# EAGLE design FluoroDuino (EAGLE 6.2)
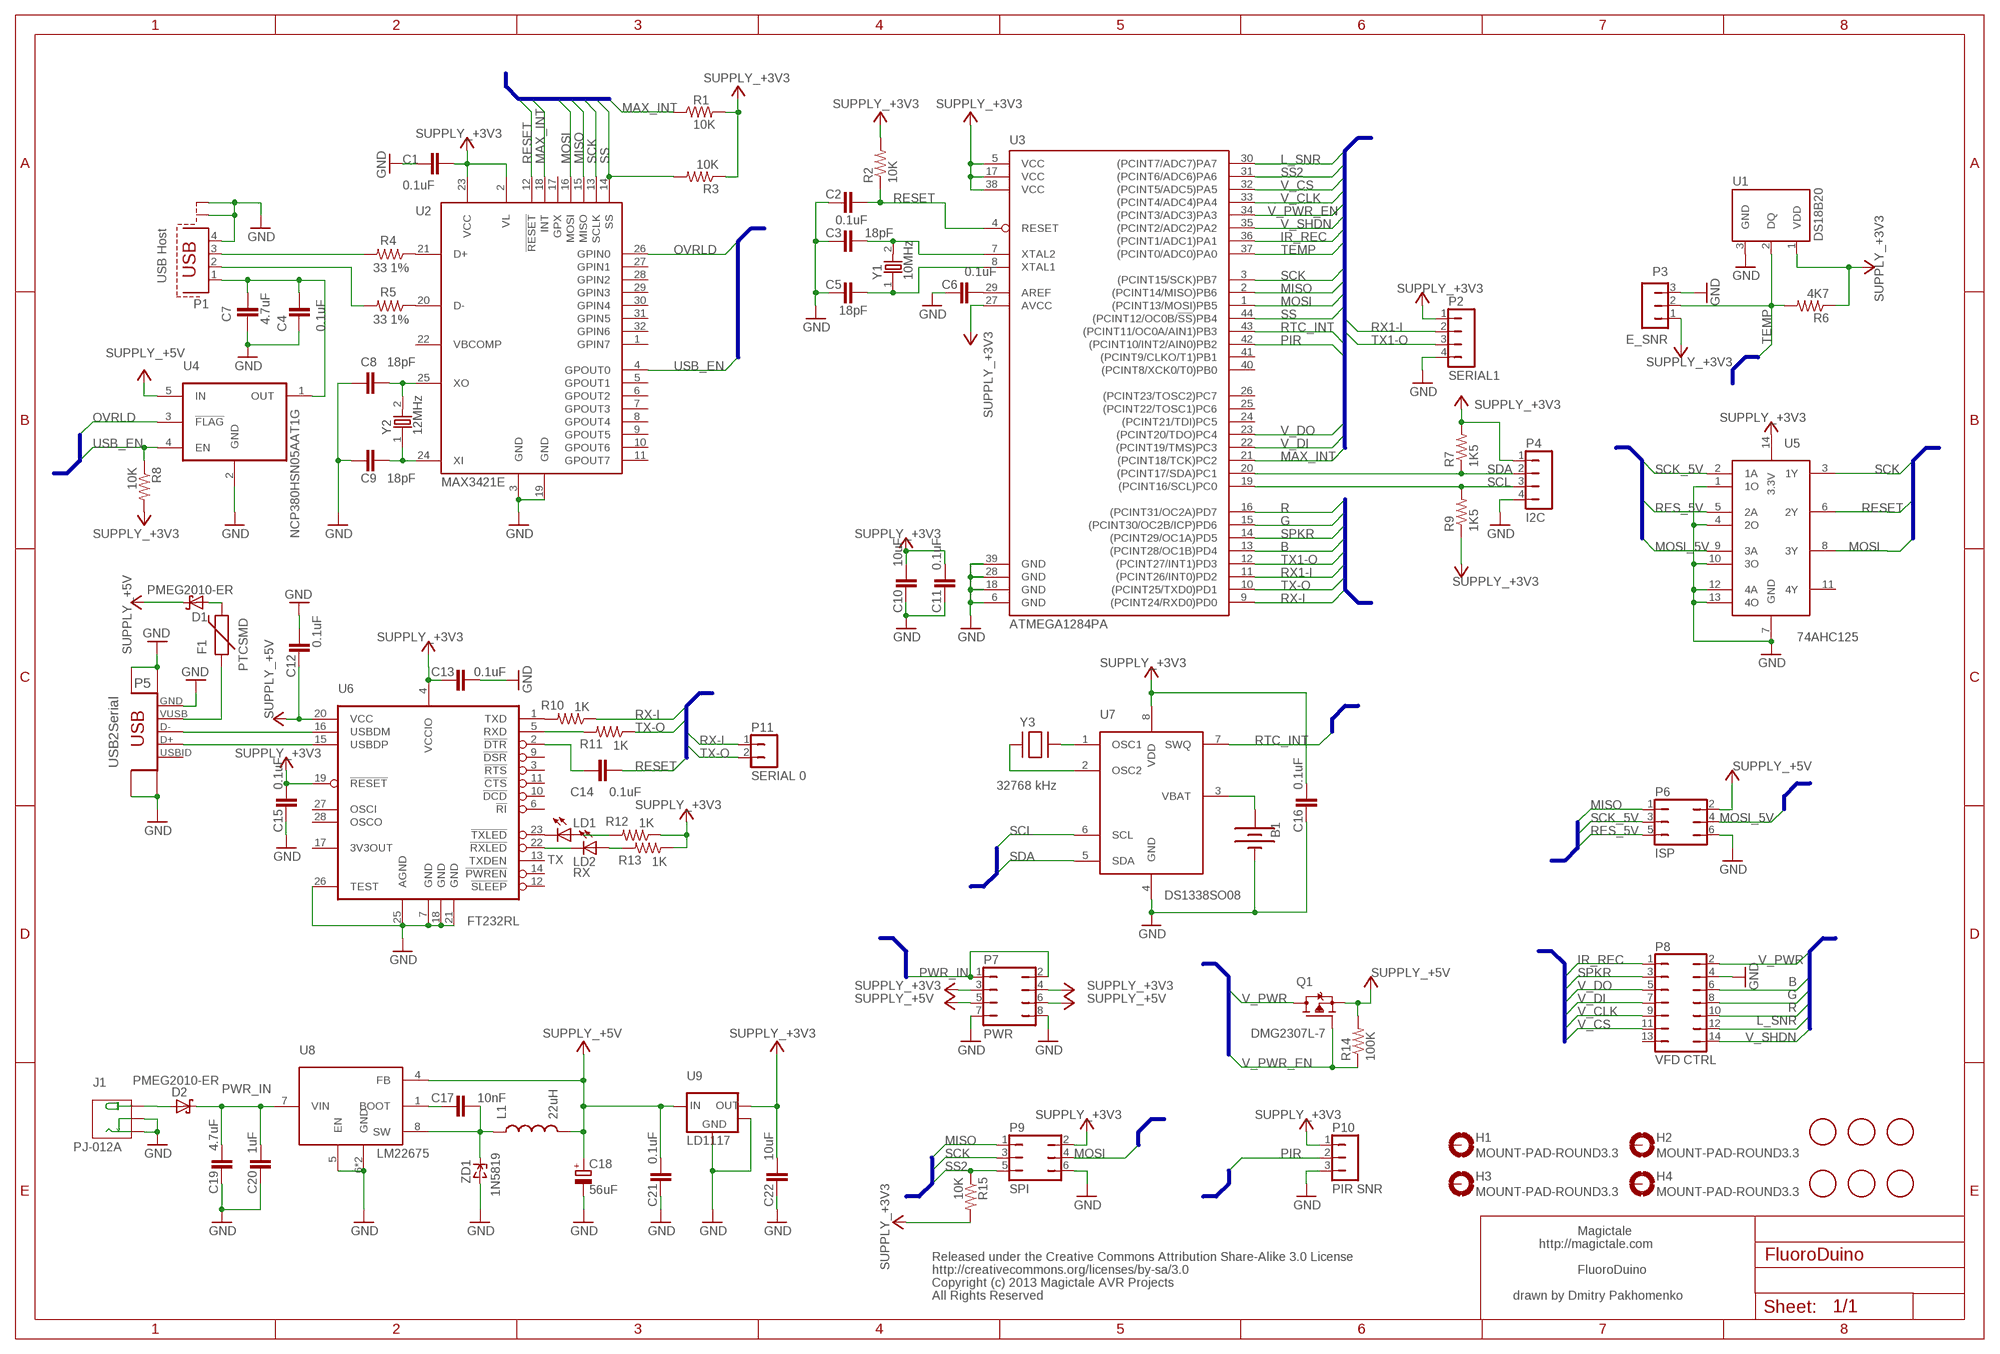
[diagram p0: schematic, sheet 1]

## Parts
B1  BATTERY20PTH  [BATTCOM_20MM_PTH]
C1  0.1uF  CAPACITOR_NPOL-1206  [C1206]
C2  0.1uF  CAPACITOR_NPOL-1206  [C1206]
C3  18pF  CAPACITOR_NPOL-1206  [C1206]
C4  0.1uF  CAPACITOR_NPOL-1206  [C1206]
C5  18pF  CAPACITOR_NPOL-1206  [C1206]
C6  0.1uF  CAPACITOR_NPOL-1206  [C1206]
C7  4.7uF  CAPACITOR_NPOL-1206  [C1206]
C8  18pF  CAPACITOR_NPOL-1206  [C1206]
C9  18pF  CAPACITOR_NPOL-1206  [C1206]
C10  10uF  CAPACITOR_NPOL-1206  [C1206]
C11  0.1uF  CAPACITOR_NPOL-1206  [C1206]
C12  0.1uF  CAPACITOR_NPOL-1206  [C1206]
C13  0.1uF  CAPACITOR_NPOL-1206  [C1206]
C14  0.1uF  CAPACITOR_NPOL-1206  [C1206]
C15  0.1uF  CAPACITOR_NPOL-1206  [C1206]
C16  0.1uF  CAPACITOR_NPOL-1206  [C1206]
C17  10nF  CAPACITOR_NPOL-1206  [C1206]
C18  56uF  CAPACITOR_POL  [PANASONIC_C]
C19  4.7uF  CAPACITOR_NPOL-1206  [C1206]
C20  1uF  CAPACITOR_NPOL-1206  [C1206]
C21  0.1uF  CAPACITOR_NPOL-1206  [C1206]
C22  10uF  CAPACITOR_NPOL-1206  [C1206]
D1  PMEG2010-ER  [SOD123]
D2  PMEG2010-ER  [SOD123]
F1  PTCSMD  [PTC-1206]
FIDUTIAL1  FIDUCIAL  [FIDUCIAL_1MM]
FIDUTIAL2  FIDUCIAL  [FIDUCIAL_1MM]
FIDUTIAL3  FIDUCIAL  [FIDUCIAL_1MM]
FIDUTIAL4  FIDUCIAL  [FIDUCIAL_1MM]
FIDUTIAL5  FIDUCIAL  [FIDUCIAL_1MM]
FIDUTIAL6  FIDUCIAL  [FIDUCIAL_1MM]
H1  MOUNT-PAD-ROUND3.3  [3,3-PAD]
H2  MOUNT-PAD-ROUND3.3  [3,3-PAD]
H3  MOUNT-PAD-ROUND3.3  [3,3-PAD]
H4  MOUNT-PAD-ROUND3.3  [3,3-PAD]
J1  PJ-012A  [PJ-012A]
L1  22uH  INDUCTOR  [VLC6045]
LD1  TX  LEDCHIPLED_1206  [CHIPLED_1206]
LD2  RX  LEDCHIPLED_1206  [CHIPLED_1206]
P1  USB Host  USB-AVERT  [USB-A-VER]
P2  SERIAL1  CONN_HEADER_1X04STRAIGHT  [CONN_HEADER_1X04]
P3  E_SNR  CONN_HEADER_1X03STRAIGHT  [CONN_HEADER_1X03]
P4  I2C  CONN_HEADER_1X04STRAIGHT  [CONN_HEADER_1X04]
P5  USB2Serial  CON-USB-F-MINI-B-RA  [CONN_USB_MINI_RA]
P6  ISP  CONN_HEADER_2X03  [CONN_HEADER_2X03]
P7  PWR  CONN_HEADER_2X04  [CONN_HEADER_2X04]
P8  VFD CTRL  CONN_HEADER_2X07F_MIRR  [CONN_HEADER_2X07_F_MIRR]
P9  SPI  CONN_HEADER_2X03  [CONN_HEADER_2X03]
P10  PIR SNR  CONN_HEADER_1X03STRAIGHT  [CONN_HEADER_1X03]
P11  SERIAL 0  CONN_HEADER_1X02  [CONN_HEADER_1X02]
Q1  DMG2307L-7  TRANSISTOR_FET_TSM2301CX  [SOT-23]
R1  10K  RESISTOR-1206  [R1206]
R2  10K  RESISTOR-1206  [R1206]
R3  10K  RESISTOR-1206  [R1206]
R4  33 1%  RESISTOR-1206  [R1206]
R5  33 1%  RESISTOR-1206  [R1206]
R6  4K7  RESISTOR-1206  [R1206]
R7  1K5  RESISTOR-1206  [R1206]
R8  10K  RESISTOR-1206  [R1206]
R9  1K5  RESISTOR-1206  [R1206]
R10  1K  RESISTOR-1206  [R1206]
R11  1K  RESISTOR-1206  [R1206]
R12  1K  RESISTOR-1206  [R1206]
R13  1K  RESISTOR-1206  [R1206]
R14  100K  RESISTOR-1206  [R1206]
R15  10K  RESISTOR-1206  [R1206]
U1  DS18B20  [TO-92-AMMO]
U2  MAX3421E  MAXIM_MAX3421E  [TQFP32-08]
U3  ATMEGA1284PA  [TQFP44]
U4  NCP380HSN05AAT1G  POWERSW_FIX-SOT5-1  [SOT23-5]
U5  74AHC125  CH_LOGIC_74125_33V-SO  [SO014]
U6  FT232RL  IC_FT232RL  [SSOP-28]
U7  DS1338SO08  ICS_DS1338SO08  [SO08]
U8  LM22675  ICS_LM22675  [SO08_POWER_PAD]
U9  LD1117  V_REG_LD1117SOT223  [SOT223]
U$  MT_LOGOCOMPACT  [MT_LOGO_COMPACT]
Y1  10MHz  OSC-XTAL-12M  [XTAL_4X6]
Y2  12MHz  OSC-XTAL-12M  [XTAL_4X6]
Y3  32768 kHz  XTAL-3.2X1.5  [XTAL3215]
ZD1  1N5819  ZENERSOD-123  [SOD123]

## Nets
+3V3: C1.1 C10.2 C11.2 C13.1 C15.2 C16.2 C22.2 P2.1 P3.1 P4.1 P7.3 P7.4 P9.2 P10.1 R1.2 R2.2 R3.1 R6.1 R7.2 R8.2 R9.1 R12.1 R13.1 R15.2 U1.1(VDD) U2.2(VL) U2.23(VCC) U3.5(VCC) U3.17(VCC) U3.27(AVCC) U3.38(VCC) U5.14(3.3V) U6.4(VCCIO) U6.19(!RESET) U7.8(VDD) U9.2(OUT) ; supply symbol labelled SUPPLY_+3V3
+5V: C12.1 C18.+ C21.2 D1.C L1.2 P6.2 P7.5 P7.6 Q1.2(S) R14.2 U4.5(IN) U6.20(VCC) U8.4(FB) U9.3(IN) ; supply symbol labelled SUPPLY_+5V
B: P8.6 U3.13((PCINT28/OC1B)PD4)
G: P8.8 U3.15((PCINT30/OC2B/ICP)PD6)
GND [power]: B1.2(-) C1.2 C2.1 C3.1 C4.2 C5.1 C6.1 C7.1 C8.1 C9.1 C10.1 C11.1 C12.2 C13.2 C15.1 C16.1 C18.- C19.1 C20.1 C21.1 C22.1 J1.2 J1.3 P1.4 P1.S1 P1.S2 P2.4 P3.3 P4.4 P5.5(GND) P5.S1(BODY) P5.S2(BODY) P5.S3(BODY) P5.S4(BODY) P6.6 P7.7 P7.8 P8.4 P9.6 P10.3 U1.3(GND) U2.3(GND) U2.19(GND) U3.6(GND) U3.18(GND) U3.28(GND) U3.39(GND) U4.2(GND) U5.1(1O) U5.4(2O) U5.7(GND) U5.10(3O) U5.12(4A) U5.13(4O) U6.7(GND) U6.18(GND) U6.21(GND) U6.25(AGND) U6.26(TEST) U7.4(GND) U8.5(EN) U8.6(GND) U8.BODY@1(GND) U9.1(GND) U9.4(OUT) ZD1.A
IR_REC: P8.1 U3.36((PCINT1/ADC1)PA1)
L_SNR: P8.12 U3.30((PCINT7/ADC7)PA7)
MAX_INT: R1.1 U2.18(INT) U3.21((PCINT18/TCK)PC2)
MISO: P6.1 P9.1 U2.15(MISO) U3.2((PCINT14/MISO)PB6)
MOSI: P9.4 U2.16(MOSI) U3.1((PCINT13/MOSI)PB5) U5.8(3Y)
MOSI_5V: P6.4 U5.9(3A)
N$1: U7.1(OSC1) Y3.P$2
N$2: U7.2(OSC2) Y3.P$1
N$3: B1.1(+) U7.3(VBAT)
N$4: P5.3(D+) U6.15(USBDP)
N$5: P5.2(D-) U6.16(USBDM)
N$6: D1.A F1.2
N$7: LD1.C U6.23(!TXLED)
N$8: R11.2 U6.5(RXD)
N$9: R10.2 U6.1(TXD)
N$10: LD2.C U6.22(!RXLED)
N$11: LD1.A R12.2
N$12: LD2.A R13.2
N$13: C14.2 U6.2(!DTR)
N$14: C9.2 U2.24(XI) Y2.1
N$15: C8.2 U2.25(XO) Y2.2
N$16: R4.1 U2.21(D+)
N$17: R5.1 U2.20(D-)
N$18: P1.3 R4.2
N$19: P1.2 R5.2
N$20: F1.1 P5.1(VUSB)
N$21: D2.A J1.1
N$22: C4.1 C7.2 P1.1 U4.1(OUT)
N$23: C17.1 U8.1(BOOT)
N$24: C6.2 U3.29(AREF)
N$25: C17.2 L1.1 U8.8(SW) ZD1.C
OVRLD: U2.26(GPIN0) U4.3(!FLAG)
PIR: P10.2 U3.42((PCINT10/INT2/AIN0)PB2)
PWR_IN: C19.2 C20.2 D2.C P7.1 P7.2 U8.7(VIN)
R: P8.10 U3.16((PCINT31/OC2A)PD7)
RES_5V: P6.5 U5.5(2A)
RESET: C2.2 C14.1 R2.1 U2.12(!RESET) U3.4(RESET) U5.6(2Y)
RTC_INT: U3.43((PCINT11/OC0A/AIN1)PB3) U7.7(SWQ)
RX1-I: P2.2 U3.11((PCINT26/INT0)PD2)
RX-I: P11.1 R10.1 U3.9((PCINT24/RXD0)PD0)
SCK: P9.3 U2.13(SCLK) U3.3((PCINT15/SCK)PB7) U5.3(1Y)
SCK_5V: P6.3 U5.2(1A)
SCL: P4.3 R9.2 U3.19((PCINT16/SCL)PC0) U7.6(SCL)
SDA: P4.2 R7.1 U3.20((PCINT17/SDA)PC1) U7.5(SDA)
SPKR: P8.3 U3.14((PCINT29/OC1A)PD5)
SS: R3.2 U2.14(SS) U3.44((PCINT12/OC0B/!SS!)PB4)
SS2: P9.5 R15.1 U3.31((PCINT6/ADC6)PA6)
TEMP: P3.2 R6.2 U1.2(DQ) U3.37((PCINT0/ADC0)PA0)
TX1-O: P2.3 U3.12((PCINT27/INT1)PD3)
TX-O: P11.2 R11.1 U3.10((PCINT25/TXD0)PD1)
USB_EN: R8.1 U2.4(GPOUT0) U4.4(EN)
V_CLK: P8.9 U3.33((PCINT4/ADC4)PA4)
V_CS: P8.11 U3.32((PCINT5/ADC5)PA5)
V_DI: P8.7 U3.22((PCINT19/TMS)PC3)
V_DO: P8.5 U3.23((PCINT20/TDO)PC4)
V_PWR: P8.2 Q1.3(D)
V_PWR_EN: Q1.1(G) R14.1 U3.34((PCINT3/ADC3)PA3)
V_SHDN: P8.14 U3.35((PCINT2/ADC2)PA2)
XTAL1: C3.2 U3.7(XTAL2) Y1.2
XTAL2: C5.2 U3.8(XTAL1) Y1.1
Unconnected: H1.B3,3(MOUNT) H2.B3,3(MOUNT) H3.B3,3(MOUNT) H4.B3,3(MOUNT) P5.4(USBID) P8.13 U2.1(GPIN7) U2.5(GPOUT1) U2.6(GPOUT2) U2.7(GPOUT3) U2.8(GPOUT4) U2.9(GPOUT5) U2.10(GPOUT6) U2.11(GPOUT7) U2.17(GPX) U2.22(VBCOMP) U2.27(GPIN1) U2.28(GPIN2) U2.29(GPIN3) U2.30(GPIN4) U2.31(GPIN5) U2.32(GPIN6) U3.24((PCINT21/TDI)PC5) U3.25((PCINT22/TOSC1)PC6) U3.26((PCINT23/TOSC2)PC7) U3.40((PCINT8/XCK0/T0)PB0) U3.41((PCINT9/CLKO/T1)PB1) U5.11(4Y) U6.3(!RTS) U6.6(!RI) U6.9(!DSR) U6.10(!DCD) U6.11(!CTS) U6.12(!SLEEP) U6.13(TXDEN) U6.14(!PWREN) U6.17(3V3OUT) U6.27(OSCI) U6.28(OSCO)

## Buses
CTRLBUS:R,G,B,L_SNR,V_PWR,V_SHDN
CTRLBUS:R,G,SPKR,B,TX1-O,RX1-I,TX-O,RX-I
CTRLBUS:L_SNR,SS2,V_CS,V_CLK,V_PWR_EN,V_SHDN,IR_REC,TEMP,SCK,MISO,MOSI,SS,RTC_INT,PIR,V_DO,V_DI,MAX_INT,RX1-I,TX1-O
CTRLBUS:MOSI,MOSI_5V
CTRLBUS:MISO,SCK,SS2,SCK_5V,RES_5V
CTRLBUS:SPKR,IR_REC,V_DO,V_DI,V_CLK,V_CS,E_VSEG
CTRLBUS:SDA,SCL
CTRLBUS:RESET,MAX_INT,MOSI,MISO,SCK,SS
CTRLBUS:OVRLD,USB_EN
CTRLBUS:RX-I,TX-O,RESET
CTRLBUS:SCK,RESET,MOSI
CTRLBUS:SCK_5V,RES_5V,MOSI_5V
CTRLBUS:V_PWR,V_PWR_EN
CTRLBUS:TEMP
CTRLBUS:PIR
CTRLBUS:RTC_INT
CTRLBUS:PWR_IN

## Notes on the sheet
- Magictale
- http://magictale.com
- Released under the Creative Commons Attribution Share-Alike 3.0 License
- http://creativecommons.org/licenses/by-sa/3.0 | FluoroDuino
- Copyright (c) 2013 Magictale AVR Projects
- All Rights Reserved | drawn by Dmitry Pakhomenko

## Library data of the parts
B1 = magictale:BATTERY: Battery Holders Various common sizes : AA, AAA, 20mm coin cell and 12mm coin cell. 20MM_4LEGS, BATT-10373; DIGIKEY: BS-3-ND
C1 C2 C4 C6 C11-C16 C21 = magictale:CAPACITOR_NPOL: Non-Polarized capacitor in various packages; DIGIKEY: 445-14296-1-ND
C3 C5 C8 C9 = magictale:CAPACITOR_NPOL: Non-Polarized capacitor in various packages; DIGIKEY: 1276-1844-1-ND
C7 C19 = magictale:CAPACITOR_NPOL: Non-Polarized capacitor in various packages; DIGIKEY: 445-14685-1-ND
C10 = magictale:CAPACITOR_NPOL: Non-Polarized capacitor in various packages; DIGIKEY: 276-3044-1-ND
C17 = magictale:CAPACITOR_NPOL: Non-Polarized capacitor in various packages; DIGIKEY: 399-1234-1-ND
C18 = magictale:CAPACITOR_POL: Polarized capacitor in various packages; DIGIKEY: P16502CT-ND
C20 = magictale:CAPACITOR_NPOL: Non-Polarized capacitor in various packages; DIGIKEY: 587-1434-1-ND
C22 = magictale:CAPACITOR_NPOL: Non-Polarized capacitor in various packages; DIGIKEY: 1276-3044-1-ND
D1 D2 = TKJMixed:PMEG2010-ER: 20V Schottky Diode at 1A - Forward voltage: 340mV @ 1A; DIGIKEY: 568-6504-1-ND
F1 = SparkFun-PowerIC:PTC: Resettable Fuse PTC Resettable Fuse. Spark Fun Electronics SKU : COM-08357; DIGIKEY: 507-1798-1-ND
FIDUTIAL1-FIDUTIAL6 = adafruit:FIDUCIAL: For use by pick and place machines to calibrate the vision/machine, 1mm By microbuilder.eu
H1-H4 = holes:MOUNT-PAD-ROUND: MOUNTING PAD, round
J1 = magictale:PJ-012A; DIGIKEY: CP-012A-ND
L1 = magictale:INDUCTOR: Inductors Basic Inductor/Choke - 0603 and 1206. Footprints are not proven and vary greatly between part numbers. SRN6045- 33uH, 20% 1.4A SDR0403-560KL - 56uH, 10%, 500mA RMS/740mA peak; DIGIKEY: 445-6533-1-ND
LD1 LD2 = adafruit:LED: LED OSRAM: - CHIPLED LG R971, LG N971, LY N971, LG Q971, LY Q971, LO R971, LY R971 LH N974, LH R974 LS Q976, LO Q976, LY Q976 LO Q996 - Hyper CHIPLED LW Q18S LB Q993, LB Q99A, LB R99A - SideLED LS A670, LO A670, LY A670, LG A670, LP A670 LB A673, LV A673, LT A673, LW A673 LH A674 LY A675 LS A676, LA A676, LO A676, LY A676, LW A676 LS A679, LY A679, LG A679 - Hyper Micro SIDELED® LS Y876, LA Y876, LO Y876, LY Y876 LT Y87S - SmartLED LW L88C, LW L88S LB L89C, LB L89S, LG L890 LS L89K, LO L89K, LY L89K LS L896, LA L896, LO L896, LY L896 - TOPLED LS T670, LO T670, LY T670, LG T670, LP T670 LSG T670, LSP T670, LSY T670, LOP T670, LYG T670 LG T671, LOG T671, LSG T671 LB T673, LV T673, LT T673, LW T673 LH T674 LS T676, LA T676, LO T676, LY T676, LB T676, LH T676, LSB T676, LW T676 LB T67C, LV T67C, LT T67C, LS T67K, LO T67K, LY T67K, LW E67C LS E67B, LA E67B, LO E67B, LY E67B, LB E67C, LV E67C, LT E67C LW T67C LS T679, LY T679, LG T679 LS T770, LO T770, LY T770, LG T770, LP T770 LB T773, LV T773, LT T773, LW T773 LH T774 LS E675, LA E675, LY E675, LS T675 LS T776, LA T776, LO T776, LY T776, LB T776 LHGB T686 LT T68C, LB T68C - Hyper Mini TOPLED® LB M676 - Mini TOPLED Santana® LG M470 LS M47K, LO M47K, LY M47K Source: http://www.osram.convergy.de/; DIGIKEY: 160-1737-1-ND
P1 = magictale:USB-A; DIGIKEY: 1175-1265-ND; OC_FARNELL: unknown; OC_NEWARK: unknown
P2 P4 = magictale:CONN_HEADER_1X04: 2.54 1x4 Header; DIGIKEY: SAM1034-02-ND; F_PIN: 1; L_PIN: 4
P3 P10 = magictale:CONN_HEADER_1X03: 2.54 1x3 Header; DIGIKEY: SAM1034-02-ND; F_PIN: 1; L_PIN: 3
P5 = magictale:CON-USB-F: USB Female connector; DIGIKEY: 732-2735-ND
P6 P9 = magictale:CONN_HEADER_2X03: 2.54 2x3 Header; DIGIKEY: 609-3210-ND; F_PIN: 1; L_PIN: 5
P7 = magictale:CONN_HEADER_2X04: 2.54 2x4 Header; DIGIKEY: 609-3235-ND; F_PIN: 1; L_PIN: 7
P8 = magictale:CONN_HEADER_2X07: JUMPER; DIGIKEY: OR1103-ND
P11 = magictale:CONN_HEADER_1X02; DIGIKEY: SAM1034-01-ND
Q1 = dp_devices:TRANSISTOR_FET_TSM2301CX: 20V P-Channel Enhancement Mode MOSFET; DIGIKEY: DMG2307L-7DICT-ND
R1-R3 R8 R15 = magictale:RESISTOR; DIGIKEY: RMCF1206JT10K0CT-ND
R4 R5 = magictale:RESISTOR; DIGIKEY: RMCF1206JT33R0
R6 = magictale:RESISTOR; DIGIKEY: RMCF1206JT4K70CT-ND
R7 R9 = magictale:RESISTOR; DIGIKEY: RNCP1206FTD1K50CT-ND
R10-R13 = magictale:RESISTOR; DIGIKEY: RMCF1206JT1K00CT-ND
R14 = magictale:RESISTOR; DIGIKEY: RMCF1206JT100KCT-ND
U1 = magictale:DS18B20: Alternate TO-92 NPN BJT; DIGIKEY: DS18B20+T&RCT-ND
U2 = magictale:MAXIM_MAX3421E; DIGIKEY: MAX3421EEHJ+-ND
U3 = TKJMixed:ATMEGA1284P: 8-bit Microcontroller with 128K Bytes In-System Programmable Flash Source: http://www.atmel.com/Images/doc8272.pdf Based on ATmega644; DIGIKEY: ATMEGA1284P-AURCT-ND; MPN: ATMEGA1284P-10AU
U4 = CH_misc_IC:POWERSW_FIX: USB power switch with fixed current limit. Package variant 1 fits OnSemi NCP380 , TI TPS20xxC, variant 2 fits Micrel MIC20X5, MIC2005A, MAX4789, MAX4791, MAX4793; DIGIKEY: NCP380HSN05AAT1GOSCT-ND
U5 = magictale:CH_LOGIC_74125_33V; DIGIKEY: 296-4530-1-ND
U6 = dp_devices:IC_FT232RL: USB to serial UART interface; DIGIKEY: 768-1007-1-ND
U7 = magictale:ICS_DS1338; DIGIKEY: DS1338U-33+T&RCT-ND
U8 = magictale:ICS_LM22675; DIGIKEY: LM22675MR-5.0/NOPB-ND
U9 = magictale:V_REG_LD1117: Voltage Regulator LM1117 Standard adjustable voltage regulator but in SMD form. Spark Fun Electronics SKU : COM-00595; DIGIKEY: 497-1241-1-ND
U$ = magictale:MT_LOGO; LICENSE: CC3.0; PCBREV: REV 1.0, 2013.12.07; PROJECT: FluoroDuino; URL: http://magictale.com
Y1 = magictale:OSC-XTAL; DIGIKEY: 535-9833-1-ND
Y2 = magictale:OSC-XTAL; DIGIKEY: 535-9836-1-ND
Y3 = adafruit:XTAL: Low cost SMT crystals, no capacitors included http://www.ladyada.net/library/eagle; DIGIKEY: 300-8816-1-ND
ZD1 = magictale:ZENER: Zener Diode SOD-323; DIGIKEY: 1N5819HW-FDICT-ND

## Net classes
0 default: width 0.203 mm, drill 0.305 mm, clearance 0.152 mm
1 power: width 0.254 mm, drill 0.508 mm, clearance 0.203 mm
3 usbvcc: width 0.203 mm, drill 0.305 mm, clearance 0.152 mm

## Board
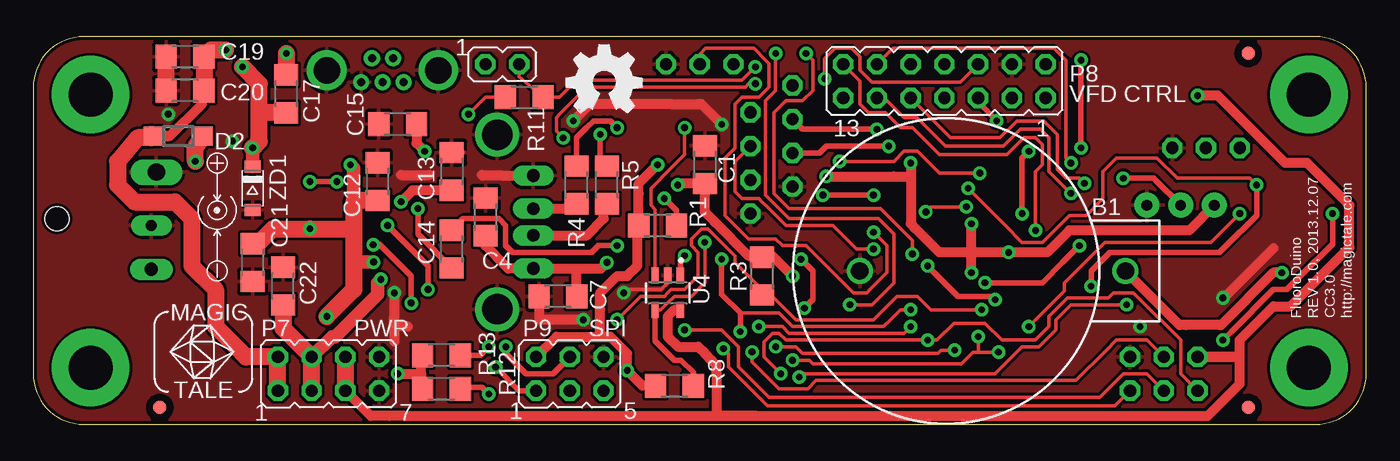
[diagram p1: board, top side]
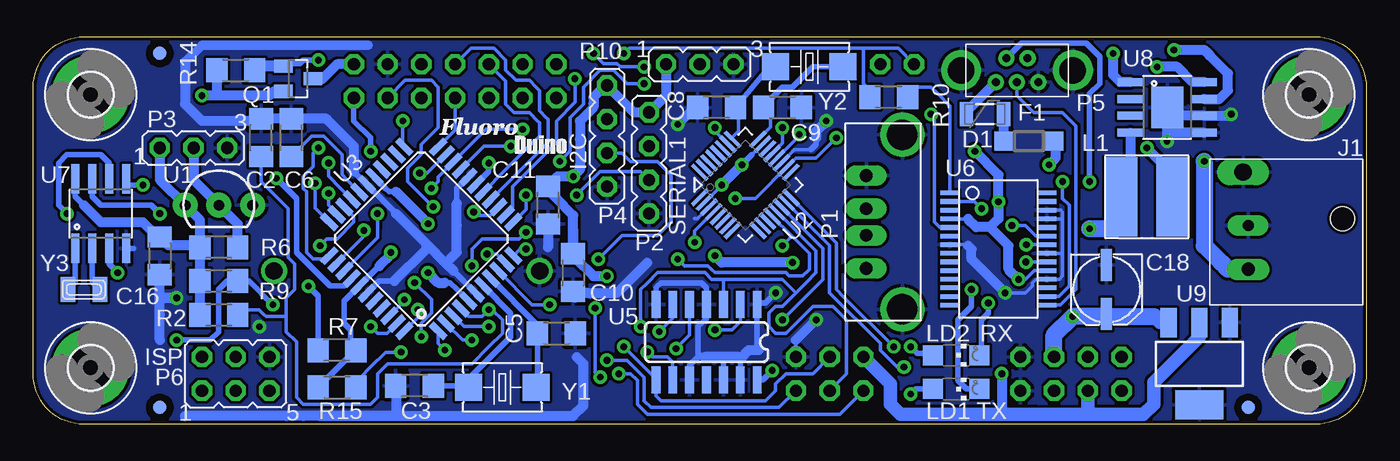
[diagram p2: board, bottom side, seen from below]

Size 100.33 x 29.2 mm. Coordinates in mm from the lower left corner, seen from the top.
Outline: 0,25.39 0,3.81 arc90 3.81,0 96.52,0 arc90 100.33,3.81 100.33,25.39 arc90 96.52,29.2 3.81,29.2 arc90 0,25.39
Copper layers (1*16): Top 0.035mm / dielectric 1.5mm / Bottom 0.035mm
Design rules: minimum track width 8mil, minimum drill 20mil, track to track 8mil, track to pad 8mil, pad to pad 8mil, via to via 8mil, smd to smd 8mil, copper to edge 10mil, drill to drill 8mil, minimum pad ring 12mil, minimum via ring 10mil, stop-mask expansion 4mil, vias tented up to drill 25mil, thermal gap 10mil

### Footprints (pad centres in the part's own frame; a part is rotated, then mirrored left to right if it is on the bottom)
BATTCOM_20MM_PTH = drill 1.3: 1 13.5,0; 2 -6.5,0
C1206 = smd 1.6 x 1.803: 1 -1.422,0; 2 1.422,0
PANASONIC_C = smd 2.4 x 0.8: + 1.85,0; - -1.85,0
SOD123 = smd 1.4 x 1.4: A 1.9,0; C -1.9,0
PTC-1206 = smd 1 x 1.8: 1 -1.4,0; 2 1.4,0
FIDUCIAL_1MM = smd 1 x 1: 1 0,0
3,3-PAD = drill 3.3 pad 5.842: B3,3 0,0
PJ-012A = drill 0.991 pad 1.524 long: 1 -3.81,7.112 | drill 1.295 long: 2 3.505,7.493 | drill 0.813 pad 1.524 long: 3 -0.508,7.112 | hole 1.803: 0,0
VLC6045 = smd 2.438 x 5.994: 1 -1.93,0; 2 1.93,0
CHIPLED_1206 = smd 1.5 x 1.5: A 0,-1.75; C 0,1.75
USB-A-VER = drill 0.95 long: 1 -3.5,2.71; 2 -1,2.71; 3 1,2.71; 4 3.5,2.71 | drill 2.3 pad 2.9: S1 -6.57,0; S2 6.57,0
CONN_HEADER_1X04 = drill 0.914 octagon: 1 -3.81,0; 2 -1.27,0; 3 1.27,0; 4 3.81,0
CONN_HEADER_1X03 = drill 0.914 octagon: 1 -2.54,0; 2 0,0; 3 2.54,0
CONN_USB_MINI_RA = drill 0.6: 1 0.9,-1.6; 2 -0.9,-0.8; 3 0.9,0; 4 -0.9,0.8; 5 0.9,1.6 | drill 2: S1 0,-4.2; S2 0,4.2; S3 0,4.2; S4 0,-4.2
CONN_HEADER_2X03 = drill 0.914 octagon: 1 -2.54,-1.27; 2 -2.54,1.27; 3 0,-1.27; 4 0,1.27; 5 2.54,-1.27; 6 2.54,1.27
CONN_HEADER_2X04 = drill 0.914 octagon: 1 -3.81,-1.27; 2 -3.81,1.27; 3 -1.27,-1.27; 4 -1.27,1.27; 5 1.27,-1.27; 6 1.27,1.27; 7 3.81,-1.27; 8 3.81,1.27
CONN_HEADER_2X07_F_MIRR = drill 0.914 octagon: 1 -7.62,-1.27; 2 -7.62,1.27; 3 -5.08,-1.27; 4 -5.08,1.27; 5 -2.54,-1.27; 6 -2.54,1.27; 7 0,-1.27; 8 0,1.27; 9 2.54,-1.27; 10 2.54,1.27; 11 5.08,-1.27; 12 5.08,1.27; 13 7.62,-1.27; 14 7.62,1.27
CONN_HEADER_1X02 = drill 0.914 octagon: 1 -1.27,0; 2 1.27,0
SOT-23 = smd 1 x 1.4: 1 -0.95,-1.1; 2 0.95,-1.1; 3 0,1.1
R1206 = smd 1.6 x 1.803: 1 -1.422,0; 2 1.422,0
TO-92-AMMO = drill 0.813 pad 1.88: 1 -2.54,0; 2 0,0; 3 2.54,0
TQFP32-08 = smd 0.294 x 1.6: 1 -1.75,-3.1; 2 -1.25,-3.1; 3 -0.75,-3.1; 4 -0.25,-3.1; 5 0.25,-3.1; 6 0.75,-3.1; 7 1.25,-3.1; 8 1.75,-3.1; 17 1.75,3.1; 18 1.25,3.1; 19 0.75,3.1; 20 0.25,3.1; 21 -0.25,3.1; 22 -0.75,3.1; 23 -1.25,3.1; 24 -1.75,3.1 | smd 1.6 x 0.294: 9 3.1,-1.75; 10 3.1,-1.25; 11 3.1,-0.75; 12 3.1,-0.25; 13 3.1,0.25; 14 3.1,0.75; 15 3.1,1.25; 16 3.1,1.75; 25 -3.1,1.75; 26 -3.1,1.25; 27 -3.1,0.75; 28 -3.1,0.25; 29 -3.1,-0.25; 30 -3.1,-0.75; 31 -3.1,-1.25; 32 -3.1,-1.75
TQFP44 = smd 1.5 x 0.5: 1 -5.8,4; 2 -5.8,3.2; 3 -5.8,2.4; 4 -5.8,1.6; 5 -5.8,0.8; 6 -5.8,0; 7 -5.8,-0.8; 8 -5.8,-1.6; 9 -5.8,-2.4; 10 -5.8,-3.2; 11 -5.8,-4; 23 5.8,-4; 24 5.8,-3.2; 25 5.8,-2.4; 26 5.8,-1.6; 27 5.8,-0.8; 28 5.8,0; 29 5.8,0.8; 30 5.8,1.6; 31 5.8,2.4; 32 5.8,3.2; 33 5.8,4 | smd 0.5 x 1.5: 12 -4,-5.8; 13 -3.2,-5.8; 14 -2.4,-5.8; 15 -1.6,-5.8; 16 -0.8,-5.8; 17 0,-5.8; 18 0.8,-5.8; 19 1.6,-5.8; 20 2.4,-5.8; 21 3.2,-5.8; 22 4,-5.8; 34 4,5.8; 35 3.2,5.8; 36 2.4,5.8; 37 1.6,5.8; 38 0.8,5.8; 39 0,5.8; 40 -0.8,5.8; 41 -1.6,5.8; 42 -2.4,5.8; 43 -3.2,5.8; 44 -4,5.8
SOT23-5 = smd 0.55 x 1.2: 1 -0.95,-1.3; 2 0,-1.3; 3 0.95,-1.3; 4 0.95,1.3; 5 -0.95,1.3
SO014 = smd 0.66 x 2.032: 1 -3.81,-2.807; 2 -2.54,-2.807; 3 -1.27,-2.807; 4 0,-2.807; 5 1.27,-2.807; 6 2.54,-2.807; 7 3.81,-2.807; 8 3.81,2.87; 9 2.54,2.87; 10 1.27,2.87; 11 0,2.87; 12 -1.27,2.87; 13 -2.54,2.87; 14 -3.81,2.87
SSOP-28 = smd 0.348 x 1.397: 1 -4.225,-3.656; 2 -3.575,-3.656; 3 -2.925,-3.656; 4 -2.275,-3.656; 5 -1.625,-3.656; 6 -0.975,-3.656; 7 -0.325,-3.656; 8 0.325,-3.656; 9 0.975,-3.656; 10 1.625,-3.656; 11 2.275,-3.656; 12 2.925,-3.656; 13 3.575,-3.656; 14 4.225,-3.656; 15 4.225,3.656; 16 3.575,3.656; 17 2.925,3.656; 18 2.275,3.656; 19 1.625,3.656; 20 0.975,3.656; 21 0.325,3.656; 22 -0.325,3.656; 23 -0.975,3.656; 24 -1.625,3.656; 25 -2.275,3.656; 26 -2.925,3.656; 27 -3.575,3.656; 28 -4.225,3.656
SO08 = smd 0.61 x 2.21: 1 -1.905,-2.616; 2 -0.635,-2.616; 3 0.635,-2.616; 4 1.905,-2.616; 5 1.905,2.616; 6 0.635,2.616; 7 -0.635,2.616; 8 -1.905,2.616
SO08_POWER_PAD = smd 0.61 x 1.905: 1 -1.905,-2.781; 2 -0.635,-2.781; 3 0.635,-2.781; 4 1.905,-2.781; 5 1.905,2.781; 6 0.635,2.781; 7 -0.635,2.781; 8 -1.905,2.781 | smd 3.099 x 2.413: BODY@1 0,0
SOT223 = smd 1.219 x 2.235: 1 -2.311,-3.099; 2 0,-3.099; 3 2.311,-3.099 | smd 3.6 x 2.2: 4 0,3.099
XTAL_4X6 = smd 2.032 x 2.032: 1 -2.54,0; 2 2.54,0
XTAL3215 = smd 1.1 x 1.9: P$1 1.2,0; P$2 -1.2,0
SOD123' = smd 0.91 x 1.22: A 1.635,0; C -1.635,0

### Placement (x,y rotation side)
B1  68.71,11.56 0 top
C1  50.55,19.56 90 top
C2  83.19,21.59 270 bottom
C3  71.63,2.92 0 bottom
C4  34.04,15.62 90 top
C5  60.96,6.86 180 bottom
C6  80.9,21.59 270 bottom
C7  39.5,9.65 0 top
C8  48.9,23.88 0 bottom
C9  43.94,23.88 180 bottom
C10  59.69,11.43 90 bottom
C11  61.59,16.51 90 bottom
C12  25.91,18.29 90 top
C13  31.5,19.05 90 top
C14  31.5,13.21 270 top
C15  27.43,22.61 0 top
C16  90.81,12.7 90 bottom
C17  19.05,24.89 270 top
C18  19.56,10.16 270 bottom
C19  11.43,27.69 0 top
C20  11.43,25.15 0 top
C21  16.51,12.19 90 top
C22  18.8,10.41 270 top
D1  25.4,21.34 180 bottom
D2  10.92,21.72 0 top
F1  28.7,23.37 0 bottom
FIDUTIAL1  90.81,27.94 0 bottom
FIDUTIAL2  91.44,27.94 0 top
FIDUTIAL3  8.89,1.27 0 bottom
FIDUTIAL4  9.53,1.27 0 top
FIDUTIAL5  90.81,1.27 0 bottom
FIDUTIAL6  91.44,1.27 0 top
H1  4.32,24.84 0 bottom
H2  96.01,24.84 0 bottom
H3  4.32,4.27 0 bottom
H4  96.01,4.27 0 bottom
J1  1.78,15.49 90 bottom
L1  16.51,17.14 180 bottom
LD1  30.86,2.67 270 bottom
LD2  30.86,5.21 270 bottom
P1  34.92,15.24 90 bottom
P2  53.98,19.68 270 bottom
P3  88.27,20.83 0 bottom
P4  57.15,21.72 270 bottom
P5  26.29,26.67 270 bottom
P6  85.09,3.81 0 bottom
P7  22.23,3.81 0 top
P8  68.58,25.86 0 bottom
P9  40.39,3.81 0 top
P10  50.16,27.13 0 bottom
P11  35.31,27.13 0 top
Q1  80.39,26.04 270 bottom
R1  46.99,14.99 180 top
R2  86.36,8.26 180 bottom
R3  54.86,11.18 270 top
R4  40.89,18.03 270 top
R5  43.18,18.03 270 top
R6  86.36,13.34 0 bottom
R7  77.47,5.59 0 bottom
R8  48.26,2.92 180 top
R9  86.36,10.79 0 bottom
R10  35.94,24.64 0 bottom
R11  36.96,24.64 180 top
R12  30.73,2.67 0 top
R13  30.73,5.21 0 top
R14  85.09,26.67 180 bottom
R15  77.47,2.79 180 bottom
U1  86.36,16.51 0 bottom
U2  46.74,18.03 315 bottom
U3  71.12,13.97 135 bottom
U4  47.75,9.91 180 top
U5  49.66,6.22 180 bottom
U6  27.69,13.21 270 bottom
U7  95.25,15.88 0 bottom
U8  14.99,23.88 270 bottom
U9  12.57,4.57 180 bottom
U$  12.57,5.21 270 top
U$1  [FLUORODUINO_LOGO]  69.85,20.32 0 bottom
U$3  [LOGO_OSHW_FILLX200_NOTEXT]  40.13,23.5 0 top
Y1  65.02,2.79 180 bottom
Y2  41.91,26.92 180 bottom
Y3  96.52,10.16 0 bottom
ZD1  1N5819  [SOD123']  16.51,17.78 270 top

### Tracks (layer width: path | path; a pad name or v marks a point on that pad's centre or on a via)
+3V3  (via drill 0.51)
  Top 0.762: U1.1 87,14.61 83.19,14.61 81.92,14.61 77.98,14.61 76.33,12.95 v73.41,12.95 70.61,12.95 | v70.61,11.43 70.61,12.7 70.61,12.95 | 70.61,12.95 v70.61,15.11 | 66.42,14.73 66.29,14.86 | v59.69,18.67 64.77,18.67 65.91,18.67 66.04,18.8 | R8.2 45.85,2.92 v44.7,4.06 44.7,5.33 43.43,6.6 | P9.2 39.37,6.6 42.67,6.6 | 42.67,6.6 43.43,6.6 | 43.43,6.6 42.67,6.6 | 42.67,6.6 42.67,8.64 42.67,9.91 43.94,11.18 44.7,11.18 45.47,11.94 45.47,14.88 R1.2 45.57,17.37 45.57,18.14 v46.99,19.56 | 66.42,14.73 67.94,13.21 68.2,12.95 69.09,12.95 70.61,12.95 | v48.51,18.03 48.62,18.14 C1.1 50.55,16 51.31,15.24 53.85,12.7 54.76,12.7 R3.1 55.27,12.7 55.63,12.7 v57.15,11.18 | v27.43,3.81 29.21,3.81 | 29.21,3.81 29.21,5.11 R13.1 | 29.21,3.81 29.21,2.77 R12.1 | C13.1 28.55,17.63 v27.69,16.76 | C15.2 28.85,21.18 v29.46,20.57 | v66.04,19.68 66.04,18.8 | 66.04,18.8 66.04,15.11 66.42,14.73
  Top 1.016: P7.4 22.48,6.6 22.73,6.6 25.91,9.78 25.91,10.67 v26.16,10.92
  Top 1.27: P7.3 P7.4 18.8,7.24 C22.2
  Bottom 0.254: U2.23 46.23,20.32 | v48.51,18.03 48.77,17.77 U2.2 | U6.4 29.98,15.48 | U6.19 24.99,11.58 25.15,11.43 25.4,11.18 25.65,10.92 v26.16,10.92
  Bottom 0.406: U7.8 97.16,17.14 96.52,16.51 | U3.27 73.8,17.78 73.55,17.53 73.03,17.53 | 74.3,11.93 U3.38 76.94,9.28 76.94,7.59 76.45,7.11 76.45,5.99 R7.2 76.1,5.59 R15.2 | U3.5 68.44,10.16 68.95,10.67 69.34,10.67 | v66.04,19.68 66.04,19.05 U3.17 | U5.14 45.41,3.35 v44.7,4.06 | 46.23,20.32 v46.99,19.56
  Bottom 0.762: C10.2 59.69,14.61 | R2.2 R9.1 | 87.93,10.64 R9.1 | R9.1 R6.1 | R6.1 87.78,15.39 | 87.78,15.39 U1.1 | P3.1 90.81,18.41 U1.1 | 96.52,16.51 95.25,15.24 92.08,15.24 90.81,13.97 C16.2 90.17,13.49 87.93,13.49 R6.1 | 87.78,15.39 U1.1 | 59.69,14.61 C10.2 | 87.78,15.39 U1.1 | C10.2 59.54,12.7 59.54,12.55 58.17,11.18 v57.15,11.18 | C11.2 61.44,17.78 | v70.61,15.11 73.03,17.53 | v70.61,11.43 69.85,10.67 69.34,10.67 | v73.41,12.95 73.41,12.81 74.3,11.93 | v46.99,19.56 v48.51,18.03 | v27.43,3.81 27.43,0.76 | 28.32,14.86 28.19,14.73 26.92,13.46 26.92,11.68 v26.16,10.92 | 28.32,14.86 29.36,14.86 29.98,15.48 | v29.46,20.57 27.69,18.8 v27.69,16.76 27.69,15.49 28.32,14.86 | 59.69,14.61 59.69,15.75 60.96,17.02 61.59,17.65 C11.2 | C11.2 60.86,18.67 v59.69,18.67 59.18,19.18 59.18,19.56 59.18,21.46 59.18,22.86 58.17,23.88 58.17,24.13 58.17,24.64 57.28,25.53 P4.1 55.12,23.5 P2.1 52.83,24.64 52.7,24.77 P10.1
  Bottom 1.016: 20.95,0.76 24.89,0.76 27.43,0.76 35.05,0.76 35.81,1.52 35.81,2.03 35.81,3.05 P9.2 | 20.95,0.76 P7.3 | 20.95,0.76 16.76,0.76 16,1.52 16,3.17 12.57,6.6 U9.2
+5V  (via drill 0.51)
  Top 0.406: U4.5 48.48,8.61
  Top 0.762: 51.44,0.64 27.94,0.64 26.8,0.64 25.4,0.64 P7.5 | 51.44,0.64 54.48,0.64 | 54.48,0.64 51.82,0.64 | 51.82,0.64 54.48,0.64 | 54.48,0.64 87.63,0.64 88.39,0.64 89.92,2.16 90.81,3.05 90.81,5.08 | 90.81,5.08 P6.2 90.81,5.08 | 90.81,5.08 90.81,6.35 93.34,8.89 94.61,8.89 99.06,13.34 99.06,16.51 95.89,19.68 94.23,19.68 90.42,23.5 89.15,24.77 v87.63,24.77 | 51.44,0.64 51.44,3.81 51.44,4.45 51.31,4.57 51.05,4.83 50.55,5.33 50.04,5.84 48.51,5.84 47.75,6.6 47.75,8.13 48.23,8.61 48.48,8.61 | 51.44,0.64 54.48,0.64 | 54.48,0.64 51.82,0.64 | 23.62,14.73 24.13,14.73 | 24.23,16.87 24.13,16.76 | 24.17,12.23 24.13,12.19 24.13,11.68
  Top 1.016: v23.88,19.56 24.13,19.3 24.13,17.53 24.13,16.76 | v25.61,12.23 24.17,12.23
  Top 1.27: P7.5 P7.6 | 23.62,14.73 v20.83,14.73 18.03,14.73 16.92,13.61 C21.2 | 24.13,16.76 24.13,15.24 24.13,14.73 24.13,11.68 24.13,11.18 24.13,10.16 v22.1,8.13 | C12.1 24.23,16.87
  Bottom 0.254: U6.20 v25.61,12.23
  Bottom 0.406: U8.4 17.77,21.86
  Bottom 0.762: Q1.2 82.23,25.09 82.55,24.77 86.36,24.77 | 86.36,24.77 87,24.77 v87.63,24.77 | R14.2 86.51,24.92 86.36,24.77 | v23.88,19.56 23.62,19.81 23.37,20.07 23.37,21.2 D1.C | L1.2 18.54,16.66 18.54,14.99 18.8,14.73 | 19.56,8.13 19.3,8.13 | 18.8,16.61 L1.2 | U8.4 17.77,17.82 L1.2
  Bottom 0.813: C18.+ 18.92,8.26 18.8,8.13
  Bottom 1.016: U9.3 15.52,7.67 15.98,8.13
  Bottom 1.27: 19.56,8.13 v22.1,8.13 23.5,6.73 P7.6 | 18.8,14.73 v20.83,14.73 | 19.3,8.13 18.8,8.13 18.41,8.13 15.98,8.13
B  (via drill 0.51)
  Top 0.254: P8.6 69.77,25.78 69.6,25.78 63.12,25.78 62.23,26.67 62.23,27.69 61.59,28.32 60.33,28.32 59.56,27.56 v59.56,26.04
  Bottom 0.254: U3.13 64.26,16.3 64.26,16.64 64.26,17.91 60.96,21.21 60.96,21.34 | 60.96,21.34 60.96,22.86 | 60.96,22.86 60.96,21.34 | 60.96,21.34 60.96,22.86 | 60.96,22.86 59.56,24.26 59.56,25.53 v59.56,26.04
G
  Bottom 0.254: P8.8 67.39,28.32 67.18,28.32 65.66,28.32 64.77,27.43 64.77,26.67 64.01,25.91 62.99,25.91 62.48,25.4 62.23,25.15 62.23,23.62 61.72,23.11 61.59,22.99 61.59,21.84 | U3.15 62.87,19.96 61.59,21.23 61.59,21.59 61.59,21.72 | 61.59,21.84 61.59,21.72 | 61.59,21.72 61.59,21.84 | 61.59,21.84 61.59,21.72
GND  (via drill 0.51)
  Top 0.254: U4.2 47.75,10.67 47.24,10.16 44.7,10.16 v44.45,9.91
  Top 0.762: v89.53,9.53 89.61,9.53 U7.4 | P7.8 26.04,5.21 | 34.04,17.47 C4.2 33.84,17.24 | P1.4 35.31,18.74 33.84,18.74 33.78,18.8 | v41.4,7.87 38.1,7.87 38.08,7.9 C7.1 | v51.82,22.61 50.29,24.13 50.04,24.13 48.01,24.13 41.91,24.13 v40.64,22.86 | 50.29,21.23 C1.2 | v27.18,9.91 27.18,8.13 27.18,7.37 | C13.2 32.11,20.47 | 27.69,18.8 29.82,18.8 | 25.7,22.91 C15.1 | 25.91,22.5 C15.1 | 10.16,24.99 C20.1 | 25.76,22.86 C15.1 | 28.19,7.37 27.18,7.37 | 27.18,7.37 27.18,6.22
  Top 1.27: C20.1 C19.1
  Bottom 0.254: U5.7 53.47,9.02 53.59,8.89 | 50.55,15.49 50.34,15.49 U2.3 | U2.19 43.03,20.68 41.8,20.68 | 30.04,13.53 29.97,13.46 | 30.04,13.53 U6.7 30.04,13.53 | U6.21 23.04,12.88 22.93,12.88 22.86,12.95 | 22.86,12.95 22.86,12.7 22.86,11.18 23.1,10.93 U6.18 24.88,10.93 25.15,10.67 25.15,10.41 25.65,9.91 26.42,9.91 26.67,9.91 v27.18,9.91 | 22.86,12.95 22.86,15.49 | 22.86,15.49 22.86,16 22.99,16.13 U6.26 | U6.25 22.87,15.48 22.86,15.49
  Bottom 0.406: 93.34,13.34 U7.4 92.79,13.26 | 76.2,19.05 73.03,15.88 74.3,17.14 U3.28 | 68.71,11.56 67.94,10.79 U3.6 | U3.39 74.3,10.79 73.15,10.79 | U3.18 68.2,18.02 68.45,17.77 68.45,16.64 | U5.13 47.12,4.95 47.24,5.08 | U5.12 48.39,4.95 48.26,5.08 | U5.10 50.93,4.45 50.29,5.08 49.78,5.08 | 49.53,5.08 49.66,5.21 50.16,5.21 50.29,5.33 50.29,7.37 49.78,7.87 49.66,8 U5.4 49.66,10.29 50.04,10.67 52.83,10.67 53.09,10.67 53.34,10.41 53.47,10.29 U5.7 | 45.72,5.59 45.85,5.71 U5.1 45.73,9.14 45.21,9.14 v44.45,9.91 | 41.4,21.59 41.4,21.08 41.8,20.68
  Bottom 0.711: 75.11,28.57 77.47,28.57 87.63,28.57 88.9,27.3
  Bottom 0.762: 88.9,27.3 88.9,24.13 87.63,22.86 85.72,22.86 83.34,22.86 C2.1 80.85,23.01 80.75,23.11 C6.1 78.26,23.01 78.11,22.86 76.2,20.95 76.2,19.05 | 73.03,0.64 74.93,0.64 76.83,0.64 78.74,0.64 73.03,0.64 | 73.03,0.64 59.69,0.64 58.93,1.4 58.93,4.57 59.44,5.08 | 73.03,0.64 80.01,0.64 81.28,0.64 88.9,0.64 | 90.81,6.35 90.81,8.26 90.81,9.53 | 90.81,9.53 C16.1 | 90.81,9.53 v89.53,9.53 90.81,9.53 | C11.1 61.59,13.34 | C10.1 59.84,10.16 59.84,10.31 | 59.54,9.53 C10.1 | 73.03,15.88 70.74,13.59 | 70.74,13.59 69.28,12.13 | 69.28,12.13 68.71,11.56 | 68.45,16.64 68.45,14.99 68.45,12.95 69.28,12.13 | 85.72,20.55 P3.3 | 73.15,10.79 70.74,13.21 70.74,13.59 | C3.1 73.03,2.77 73.03,0.64 | C10.1 59.79,9.91 58.67,9.91 56.39,9.91 55.63,10.67 54.1,12.19 | 47.24,5.08 48.26,5.08 49.53,5.08 49.78,5.08 | 45.72,5.59 46.48,5.59 47.12,4.95 | 50.42,23.52 C8.1 | C8.1 50.32,24.36 | P9.6 42.93,5.59 | 42.93,6.35 v41.4,7.87 | 54.1,15.75 P2.4 | C8.1 50.29,23.85 50.57,23.85 v51.82,22.61 | 40.64,23.01 v40.64,22.86 41.4,22.1 41.4,21.59 | v27.18,9.91 29.72,12.45 29.72,13.21 29.97,13.46 | v10.16,23.37 10.29,23.24 U8.6 14.22,23.24 14.35,23.24 U8.BODY@1 14.99,22.1 | v14.99,21.34 14.99,22.1 | U8.5 14.86,21.97 14.99,22.1
  other vias: 83.31,7.37
  pour Top: 0,3.81 0,25.4 arc-90 3.81,29.21 9.53,29.21 96.52,29.21 arc-90 100.33,25.4 100.33,22.23 100.33,3.81 arc-90 96.52,0 92.71,0 3.81,0 arc-90
  pour Bottom: 0,25.4 arc-90 3.81,29.21 4.45,29.21 96.52,29.21 arc-90 100.33,25.4 100.33,3.81 arc-90 96.52,0 95.89,0 3.81,0 arc-90 0,3.81 0,4.45
IR_REC  (via drill 0.51)
  Top 0.406: v74.93,20.57 74.42,20.07 v74.42,15.88
  Bottom 0.254: v74.42,15.88 74.42,14.73 74.42,14.06 74.93,13.55 U3.36
  Bottom 0.406: P8.1 76.2,22.86 74.93,21.59 v74.93,20.57
L_SNR  (via drill 0.51)
  Top 0.254: v78.11,19.68 77.72,20.07 77.72,27.18 77.72,27.43 76.83,28.32 70.48,28.32 64.95,28.32 64.69,28.32 P8.12
  Bottom 0.254: U3.30 77.19,17.78 78.11,18.69 v78.11,19.68
MAX_INT  (via drill 0.51)
  Top 0.254: 68.2,18.92 v71.25,18.92 | 68.2,18.92 | 68.2,18.92 67.06,20.07 66.55,20.57 65.53,20.57 64.77,19.81 v60.71,19.81 | v39.88,21.59 39.37,22.1 39.37,23.11 39.62,23.37 | 39.62,23.37 39.88,23.62 | v54.36,25.65 53.85,25.65 53.59,25.4 41.66,25.4 39.62,23.37
  Top 0.406: R1.1 48.41,16.1 v47.5,17.02
  Bottom 0.254: 69.22,20.32 69.23,20.33 U3.21 70.69,18.92 v71.25,18.92 | v60.71,19.81 59.94,20.57 59.94,23.11 58.93,24.13 58.93,25.4 57.66,26.67 56.64,26.67 56.39,26.42 55.63,25.65 v54.36,25.65 | U2.18 | U2.18 42.93,20.07 41.4,20.07 v39.88,21.59 | v47.5,17.02 45.97,17.02 44.96,18.03 44.45,18.55 U2.18
MISO  (via drill 0.51)
  Top 0.254: P6.1 86.36,3.81 86.36,6.35 85.34,7.37 84.07,8.64 83.19,9.53 82.8,9.91 81.28,9.91 80.9,9.53 80.77,9.53 80.64,9.53 78.61,9.53 77.85,9.53 76.71,8.38 76.45,8.13 76.45,7.37 75.44,6.35 72.9,6.35 71.64,7.61 71.61,7.61 U3.2 68.03,6.35 v67.31,6.35 66.04,6.35 56.64,6.35 56.13,6.86 55.63,6.86 54.99,6.22 54.99,5.08 v56.26,3.81
  Top 0.406: P9.1 36.58,2.54 v34.8,4.32
  Bottom 0.254: 68.03,6.35 U3.2 | 68.03,6.35 67.94,6.35 | 68.03,6.35 v67.31,6.35 | U2.15 40.39,13.46 40.39,9.91 36.58,6.1 36.58,5.59 35.31,4.32 v34.8,4.32 | P9.1 39.62,0.76 39.75,0.76 53.98,0.76 54.1,0.76 54.86,1.52 54.86,2.03 54.86,2.41 54.86,3.3 55.37,3.81 v56.26,3.81
MOSI  (via drill 0.51)
  Top 0.254: v69.34,5.59 68.33,5.59 68.07,5.33 57.91,5.33 57.4,5.84 56.13,5.84 v55.88,5.84
  Top 0.406: v35.56,5.84 35.56,5.33 37.08,3.81 39.12,3.81 P9.4
  Bottom 0.254: U3.1 69.85,7.11 69.85,6.1 v69.34,5.59 | v55.88,5.84 53.47,3.43 U5.8 53.47,2.16 53.09,1.78 45.21,1.78 44.45,2.54 44.45,3.05 43.69,3.81 41.66,3.81 P9.4 | v35.56,5.84 39.37,9.65 39.88,10.16 39.88,13.21 39.88,13.4 39.88,13.65 U2.16
MOSI_5V  (via drill 0.51)
  Top 0.254: P6.4 83.82,6.35 81.53,6.35 80.77,5.59 78.49,3.3 58.93,3.3 58.29,2.67 56.39,2.67 56.13,2.67 54.1,4.7 v54.1,5.46
  Bottom 0.254: U5.9 52.2,4.32 52.2,4.7 52.58,5.08 53.72,5.08 v54.1,5.46
N$1
  Bottom 0.406: U7.1 97.16,10.72 Y3.P$2
N$2
  Bottom 0.406: U7.2 95.89,10.72 Y3.P$1
N$3  (via drill 0.51)
  Top 0.762: v93.98,11.43 93.34,11.43 89.41,7.49 89.28,7.49 86.78,7.49 86.27,7.49 B1.1
  Bottom 0.406: U7.3 94.61,12.06 v93.98,11.43
N$4
  Bottom 0.254: U6.15 23.02,8.98 21.84,10.16 21.84,17.02 21.84,22.48 22.86,23.5 25.03,23.5 26.29,24.75 P5.3
N$5  (via drill 0.51)
  Top 0.406: v20.83,18.29 v22.86,18.29
  Bottom 0.254: U6.16 23.13,9.63 22.35,10.41 22.35,16.51 22.86,17.02 v22.86,18.29
  Bottom 0.406: v20.83,18.29 20.83,24.89 20.07,25.65 20.07,27.69 21.08,28.7 25.96,28.7 P5.2
N$6
  Bottom 0.762: F1.2 D1.A
N$7  (via drill 0.51)
  Top 0.406: v29.72,10.16 29.72,11.94 v26.67,14.99
  Bottom 0.254: v26.67,14.99 25.65,14.99 24.85,14.18 U6.23
  Bottom 0.406: LD1.C 30.1,2.67 30.73,3.3 30.73,7.11 30.73,7.87 29.72,8.89 v29.72,10.16
N$8  (via drill 0.51)
  Top 0.254: R11.2 34.04,24.64 v32.77,23.37
  Bottom 0.254: U6.5 32.1,14.83 32.26,14.99 32.51,15.24 32.51,23.11 v32.77,23.37
N$9
  Bottom 0.254: U6.1 31.34,23.98 32.26,24.89 32.77,25.4 33.76,25.4 R10.2
N$10  (via drill 0.51)
  Top 0.254: 26.09,13.53 26.16,13.46
  Top 0.406: 26.16,13.46 28.45,11.18 v28.45,9.14 | v25.58,13.53 26.09,13.53
  Bottom 0.254: U6.22 v25.58,13.53 | 29.21,5.31 LD2.C | LD2.C 28.96,5.36 LD2.C
  Bottom 0.406: v28.45,9.14 28.45,8.38 28.96,7.87 28.96,5.36
N$11  (via drill 0.51)
  Top 0.406: v34.29,2.29 33.78,2.79 32.28,2.79 R12.2
  Top 0.762: R12.2 LD1.A
  Bottom 0.406: LD1.A 33.91,2.67 v34.29,2.29
N$12  (via drill 0.51)
  Top 0.406: R13.2 33.66,5.21 v34.29,5.84
  Bottom 0.406: v34.29,5.84 33.78,5.33 32.74,5.33 LD2.A
N$13  (via drill 0.51)
  Top 0.406: v28.96,16.26 28.96,14.33 C14.2
  Bottom 0.254: U6.2 30.46,16.78 29.48,16.78 v28.96,16.26
N$14
  Bottom 0.254: U2.24 44.86,22.39 44.86,23.37 C9.2 45.36,23.98
  Bottom 0.406: 45.36,23.98 43.94,25.4 43.18,25.4 42.42,26.16 41.66,26.92 Y2.1
N$15
  Bottom 0.254: U2.25 47.69,21.65 47.24,22.1 47.24,24.16 C8.2 | Y2.2 44.93,26.92
  Bottom 0.406: 44.93,26.92 C8.2
N$16  (via drill 0.51)
  Top 0.406: R4.1 40.89,21.59 41.66,22.35 42.16,22.86 42.93,22.86 43.43,22.86 v43.94,22.35
  Bottom 0.254: v43.94,22.35 43.94,21.18 U2.21
N$17  (via drill 0.51)
  Top 0.254: 42.67,19.96 R5.1
  Top 0.406: v42.67,21.84 42.67,19.96
  Bottom 0.254: v42.67,21.84 42.83,21.59 U2.20
N$18
  Top 0.762: P1.3 40.52,16.24 R4.2
N$19
  Top 0.762: P1.2 41.67,14.24 42.93,15.49 42.93,16.36 R5.2
N$20
  Bottom 0.762: F1.1 30.1,23.56 P5.1
N$21  (via drill 0.51)
  Top 0.762: D2.A
  Top 1.27: v12.19,19.81 12.19,20.83 D2.A
  Bottom 1.27: v12.19,19.81 12.19,13.46 10.92,12.19 10.41,11.68 J1.1
N$22  (via drill 0.51)
  Top 0.406: U4.1 48.7,12.26 48.7,12.38 v49.02,12.7
  Top 0.762: C4.1 34.04,13.46 35.56,11.94 35.76,11.74 P1.1 37.65,11.74 41.15,11.74 | C7.2 40.89,9.68 40.89,10.16 40.89,11.49 41.15,11.74 | 41.15,11.74 42.73,11.74 v43.18,12.19
  Bottom 0.762: v43.18,12.19 48.51,12.19 v49.02,12.7
N$23  (via drill 0.51)
  Top 1.27: v19.05,27.94 C17.1
  Bottom 0.762: U8.1 18.52,25.78 C17.1 v19.05,27.94
N$24
  Bottom 0.254: 76.7,18.41 77.09,18.81 | 77.09,18.81 76.7,18.41 | 76.7,18.41 U3.29 | 76.7,18.41 77.09,18.81 | 77.09,18.81 77.09,20.32 78.49,21.72 79.38,21.72 80.64,20.45 | 80.64,20.32 80.64,20.45 | 80.64,20.45 C6.2 80.64,20.45
N$25  (via drill 0.51)
  Top 0.762: 17.17,23.47 17.02,21.34
  Top 1.016: v16.51,20.83 ZD1.C
  Top 1.27: v16.51,20.83 17.02,21.34 17.02,25.65 v15.75,26.92 | C17.2 17.17,23.47
  Bottom 0.762: v16.51,20.83 14.73,19.05 14.73,16.61 L1.1 | U8.8 13.08,25.78 14.22,26.92 v15.75,26.92
OVRLD  (via drill 0.51)
  Top 0.254: v49.02,22.35 49.02,20.32 48.01,19.3 46.48,17.78 46.48,17.27 46.48,16.51 46.8,16.19 46.8,13.27 U4.3
  Bottom 0.254: v49.02,22.35 49.02,22.09 U2.26
PIR  (via drill 0.51)
  Top 0.254: 54.1,28.32 54.23,28.32 | 54.23,28.32 54.1,28.32 | 54.1,28.32 50.6,28.32 50.16,27.89 P10.2 | v63.25,14.48 64.26,13.46 64.26,11.68 64.26,11.43 64.01,11.18 62.99,10.16 62.74,9.91 62.23,9.91 61.72,9.91 61.47,10.16 61.21,10.41 59.18,12.45 58.17,13.46 56.39,13.46 55.88,13.97 53.85,13.97 52.07,15.75 52.07,20.07 52.83,20.83 52.83,24.13 53.34,24.64 54.61,24.64 55.37,25.4 55.37,27.18 55.12,27.43 54.23,28.32 | 54.1,28.32 54.23,28.32
  Top 0.406: v67.31,11.94 69.34,9.91 69.6,9.65 71.63,9.65 72.14,9.65 v72.39,9.4
  Bottom 0.254: v67.31,11.94 67.31,13.21 66.55,13.97 63.75,13.97 v63.25,14.48 | U3.42 72.39,9.31 v72.39,9.4
PWR_IN  (via drill 0.51)
  Top 0.762: D2.C 10.29,21.72 | 10.29,21.72 12.7,24.13 12.7,24.99 C20.2 | 13.36,28.19 C19.2 | 10.29,21.72 9.27,21.72
  Top 1.27: C19.2 C20.2 | v14.48,28.19 13.36,28.19 | P7.1 P7.2 16,5.08 15.75,5.33 13.72,7.37 13.72,10.16 11.94,11.94 11.94,15.49 10.67,16.76 7.62,16.76 6.35,18.03 6.35,19.81 7.87,21.59 7.88,21.59 8.89,21.59 8.89,21.84 D2.C
  Bottom 0.762: U8.7 11.05,24.51 10.41,25.15 10.41,26.42 11.68,27.69 11.94,27.94 12.19,28.19 v14.48,28.19
R
  Bottom 0.254: U3.16 64.77,19.19 62.87,21.09 62.23,21.73 62.23,22.73 62.36,22.86 62.99,23.5 64.14,23.5 64.77,24.13 64.77,25.86 P8.10
RES_5V  (via drill 0.51)
  Top 0.254: 55.88,1.4 80.14,1.4 81.41,1.4 P6.5 | 55.88,1.4 55.75,1.4 55.88,1.4 | 55.88,1.4 55.24,1.4 52.32,4.32 52.32,5.33 v51.94,5.71
  Bottom 0.254: U5.5 50.93,6.73 v51.94,5.71
RESET  (via drill 0.51)
  Top 0.254: v66.04,8.64 65.28,8.64 64.52,7.87 64.01,7.37 57.15,7.37 56.64,7.87 56.13,8.38 54.1,8.38 53.21,8.38 | 42.52,13.46 42.47,13.41
  Top 0.406: v53.21,6.99 53.21,7.49 53.21,8.38 51.82,9.78 v51.82,12.45 | 42.47,13.41 42.01,12.95 41.4,12.95 36.07,12.95 35.56,13.46 35.56,14.99 35.05,15.49 33.02,15.49 32.36,15.49 C14.1 | v43.94,13.46 42.52,13.46
  Bottom 0.254: C2.2 83.19,18.29 82.7,17.8 81.15,16.26 81.15,12.57 80.64,12.06 80.64,10.16 81.28,9.53 81.28,8.13 | 81.28,8.13 81.28,6.99 80.52,6.22 80.52,4.57 80.52,2.03 80.01,1.52 74.93,1.52 74.42,2.03 74.42,3.81 73.66,4.57 69.98,4.57 69.85,4.57 67.31,4.57 66.04,5.84 65.02,6.86 65.02,7.87 65.79,8.64 v66.04,8.64 66.55,8.13 67.56,8.13 68.15,8.71 | U5.6 52.2,8 v53.21,6.99 | v51.82,12.45 51.31,11.94 50.8,11.94 49.53,11.94 49.28,11.68 49.02,11.43 48.26,11.43 47.75,11.43 43.69,11.43 43.43,11.18 42.42,11.18 41.91,11.68 41.91,12.7 41.91,12.85 43.23,14.17 | 43.23,14.17 U2.12 | v43.94,13.46 43.23,14.17 | 81.28,8.13 82.8,8.13 82.93,8.26 83.31,8.64 84.56,8.64 R2.1
  Bottom 0.406: U3.4 68.15,8.71
RTC_INT  (via drill 0.51)
  Top 0.254: 80.64,13.72 80.77,13.72 80.64,13.72 | 80.64,13.72 83.44,13.72 84.45,13.72 87.88,13.72 88.65,13.72 v90.81,15.88 | 80.64,13.72 80.26,13.34 77.6,10.67 77.6,10.03 v74.93,7.37
  Bottom 0.254: v74.93,7.37 74.42,6.86 73.71,6.86 U3.43
  Bottom 0.406: U7.7 95.89,17.14 95.25,16.51 91.44,16.51 v90.81,15.88
RX1-I  (via drill 0.51)
  Top 0.254: v63.25,13.21 61.98,13.21 60.96,14.22 60.2,14.99 56.64,14.99 56.39,15.24 55.63,16 55.12,16.51 54.86,16.76 54.61,17.02 53.34,17.02 52.83,17.53 52.83,19.81 P2.2
  Bottom 0.254: v63.25,13.21 63.68,13.21 U3.11
RX-I  (via drill 0.51)
  Top 0.254: v61.47,9.02 63.12,9.02 64.77,10.67 64.77,13.34 64.77,14.35 63.63,15.49 62.48,15.49 56.9,15.49 55.63,16.76 55.12,17.27 | 55.12,17.53 55.12,17.27 | 55.12,17.53 55.12,17.27 | 55.12,17.27 55.12,17.53 | 55.12,17.53 55.12,21.84 55.12,22.61 55.12,22.86 55.12,24.38 55.63,24.89 55.88,25.15 55.88,27.69 v55.88,27.94
  Bottom 0.254: 65.28,11.43 65.28,11.52 U3.9 62.77,9.02 v61.47,9.02 | 37.85,28.32 35.31,28.32 35.23,28.32 P11.1 | 37.85,28.32 37.85,28.19 37.85,26.92 37.85,25.65 37.36,25.17 R10.1 | 37.85,28.32 45.09,28.32 55.5,28.32 v55.88,27.94
SCK  (via drill 0.51)
  Top 0.254: v66.04,7.37 65.79,7.11 65.53,6.86 56.9,6.86 56.39,7.37 v54.61,7.37
  Bottom 0.254: v66.04,7.37 67.56,7.37 67.91,7.37 U3.3 | v54.61,7.37 54.61,10.16 54.1,10.67 53.34,11.43 49.78,11.43 49.28,10.92 48.51,10.92 | P9.3 39.12,3.81 39.12,7.37 39.12,7.87 40.13,8.89 41.66,8.89 43.69,6.86 44.45,6.86 44.96,7.37 44.96,8.38 44.45,8.89 43.94,8.89 43.18,9.65 42.93,9.91 | U2.13 41.4,13.05 41.4,11.43 42.16,10.67 42.93,9.91 | 42.93,9.91 43.18,10.16 43.69,10.67 43.94,10.92 46.74,10.92 48.26,10.92 48.51,10.92 | U5.3 48.39,10.79 48.51,10.92
SCK_5V  (via drill 0.51)
  Top 0.254: P6.3 83.82,3.81 83.57,3.81 82.04,3.81 80.26,2.03 55.5,2.03 55.37,2.03 53.09,4.32 53.09,4.57 53.09,5.08 53.09,5.84 51.82,7.11 v49.02,7.11
  Bottom 0.254: U5.2 47.12,7.75 47.75,7.11 v49.02,7.11
SCL  (via drill 0.51)
  Top 0.254: v57.66,3.56 57.91,3.81 58.67,3.81 60.45,3.81 72.39,3.81 74.42,5.84 75.69,5.84 76.96,7.11 76.96,7.87 77.98,8.89 78.11,9.02 v82.3,9.02
  Top 0.406: v97.79,15.88 97.79,15.24 97.79,13.59 95.25,11.05 94.36,10.16 93.34,10.16 90.17,6.99 v89.53,6.35 | v64.39,20.95 60.2,20.95 | 60.2,20.95 59.82,20.95 | 59.82,20.95 60.2,20.95 | 60.2,20.95 59.82,20.95 | 59.82,20.95 59.69,20.95 59.18,20.45 P4.3 | v58.04,8.76 58.67,9.4 58.67,11.56 v57.78,12.45
  Bottom 0.254: v64.39,20.95 66.04,20.95 66.4,20.95 U3.19 | v58.04,8.76 58.04,3.94 v57.66,3.56 | P4.3 56.01,20.45 55.37,19.81 | 55.37,19.81 53.34,19.81 | 53.34,19.81 52.32,18.8 | 55.37,19.81 53.34,19.81 | 53.34,19.81 52.32,18.8 | 52.32,18.8 52.32,15.24 53.34,14.22 56.01,14.22 v57.78,12.45
  Bottom 0.406: 84.45,10.79 R9.2 | U7.6 94.61,19.68 95.25,20.32 97.79,20.32 98.42,19.68 98.42,16.51 v97.79,15.88 | 84.45,10.79 85.09,10.79 85.72,10.79 86.36,10.16 86.36,6.99 87,6.35 88.9,6.35 v89.53,6.35 | 84.45,10.79 84.07,10.79 v82.3,9.02
SDA  (via drill 0.51)
  Top 0.254: v70.36,17.78 70.61,17.53 71.12,17.02 73.15,14.99 74.42,13.72 75.95,13.72 77.22,14.99 77.98,15.75 79.25,15.75 80.52,17.02 80.52,19.05 81.53,20.07 84.58,20.07 86.11,18.54 91.57,18.54 v92.08,18.03
  Top 0.406: v92.08,18.03 92.08,15.88 92.08,15.75 89.66,13.34 89.28,12.95 83.82,12.95 | 83.82,12.95 83.31,12.95 | v79.63,10.41 79.63,11.56 81.03,12.95 83.82,12.95 | v63.5,22.23 59.44,22.23 57.91,22.23 P4.2
  Bottom 0.254: v63.5,22.23 66.26,22.23 U3.20 69.85,18.63 69.85,18.29 v70.36,17.78
  Bottom 0.406: U7.5 93.34,18.03 92.71,18.03 v92.08,18.03 | R7.1 78.89,9.68 v79.63,10.41
SPKR  (via drill 0.51)
  Top 0.254: v67.18,16 67.56,16.38 v70.23,16.38
  Bottom 0.254: U3.14 65.95,15.75 66.93,15.75 v67.18,16 | 71.12,21.03 71.12,20.95 71.12,20.32 71.5,19.94 72.14,19.3 72.14,19.05 72.14,18.29 v70.23,16.38 | 71.12,21.03 71.12,21.08 | 71.12,21.08 71.12,21.03 | 71.12,21.03 71.12,21.08 | 71.12,21.08 69.85,22.35 69.85,25.4 70.36,25.91 72.34,25.91 P8.3
SS  (via drill 0.51)
  Top 0.254: v71.37,8.64 67.56,8.64 66.55,9.65 65.02,9.65 63.75,8.38 63.5,8.13 63.25,7.87 62.23,7.87 57.4,7.87 55.52,9.75 R3.2 | v43.94,7.87 45.72,9.65 47.5,9.65 47.75,9.91 48.01,10.16 49.02,10.16 49.78,10.92 50.04,11.18 50.04,12.95 49.53,13.46 49.53,13.97 50.29,14.73 50.8,14.73 52.83,12.7 52.83,12.19 54.1,10.92 54.36,10.67 54.61,10.41 54.61,10.01 R3.2 | R3.2 55.37,9.91 55.37,10.16
  Bottom 0.254: v71.37,8.64 71.37,8.06 U3.44 | U2.14 40.89,13.25 40.89,12.45 40.89,10.92 42.16,9.65 v43.94,7.87
SS2  (via drill 0.51)
  Top 0.254: v71.12,6.6 71.12,5.84 71.12,5.44 | v57.15,4.83 58.42,4.83 58.67,4.57 65.91,4.57 67.82,4.57 69.85,4.57 70.71,5.44 71.12,5.44 | 71.12,5.44 71.53,5.44 72.49,5.44 v72.64,5.44
  Top 0.406: v78.74,13.46 77.47,12.19 75.95,10.67 v71.63,10.67
  Bottom 0.254: v78.74,13.46 78.23,13.97 77.98,13.97 77.47,13.97 76.2,15.24 76.2,15.66 U3.31 | v71.12,6.6 71.12,7.62 70.87,7.87 70.61,8.13 70.36,8.38 70.36,9.4 v71.63,10.67 | v57.15,4.83 56.64,4.83 56.13,4.83 55.63,4.83 54.36,3.56 54.36,1.78 53.85,1.27 44.2,1.27 P9.5 | v72.64,5.44 73.66,5.44 73.81,5.44 74.93,4.32 75.69,3.56 75.69,3.15 R15.1
TEMP  (via drill 0.51)
  Top 0.406: U1.2 84.45,18.41 84.33,18.54 v82.04,18.54
  Bottom 0.406: v82.04,18.54 80.52,17.02 80.52,13.21 80.52,12.95 77.98,10.41 77.22,10.41 76.94,10.41 U3.37
  Bottom 0.762: R6.2 84.94,15.09 U1.2 88.27,18.41 P3.2
TX1-O  (via drill 0.51)
  Top 0.406: v59.44,17.27 v63.25,17.27
  Bottom 0.254: v59.44,17.27 58.42,18.29 57.66,19.05 54.61,19.05 P2.3 | v63.25,17.27 63.25,16.19 U3.12
TX-O  (via drill 0.51)
  Top 0.254: v66.17,12.83 66.17,13.84 65.79,14.22 63.75,16.26 62.48,16.26 58.67,16.26 56.9,16.26 55.75,17.4 55.75,17.65 55.75,18.29 55.75,23.5 56.64,24.38 57.91,24.38 58.67,25.15 58.67,27.43 v58.17,27.94 | v54.36,26.92 53.34,25.91 46.61,25.91 | 46.61,25.91 46.48,25.91 | 46.48,25.91 46.61,25.91 | 46.61,25.91 46.48,25.91 | 46.48,25.91 46.61,25.91 | 46.48,25.91 46.61,25.91 | 46.48,25.91 40.89,25.91 39.62,24.64 R11.1 36.58,26.19 P11.2
  Bottom 0.254: U3.10 65.45,12.83 v66.17,12.83 | v58.17,27.94 57.4,27.18 56.39,27.18 56.13,26.92 54.86,26.92 v54.36,26.92
USB_EN  (via drill 0.51)
  Top 0.254: U4.4 47.21,8.61 47.75,9.14 48.26,9.65 49.53,9.65 50.29,10.41 50.55,10.67 v50.55,13.72
  Top 0.406: R8.1 49.68,3.91 48.77,4.83 48.26,4.83 46.8,6.28 U4.4
  Bottom 0.254: v50.55,13.72 50.55,14.58 U2.4
V_CLK  (via drill 0.51)
  Top 0.254: P8.9 69.04,21.59 72.77,21.59 74.04,22.86 76.07,22.86 77.09,21.84 77.09,20.7 77.09,19.3 77.09,19.18 77.72,18.54 78.74,18.54 v79.12,18.16
  Bottom 0.254: 78.11,15.24 U3.33 79.12,16.31 v79.12,18.16
V_CS  (via drill 0.51)
  Top 0.254: 76.45,19.18 76.45,21.59 75.82,22.23 74.3,22.23 73.03,20.95 68.66,20.95 66.5,23.11 65.53,23.11 64.06,24.59 P8.11 | 76.45,19.18 76.45,19.05 | 76.45,19.05 76.45,19.18 | 76.45,19.05 76.45,19.18 | v78.11,17.4 76.45,19.05
  Bottom 0.254: v78.11,17.4 78.11,16.51 77.48,15.89 U3.32
V_DI
  Bottom 0.254: P8.7 68.58,22.17 U3.22
V_DO  (via drill 0.51)
  Top 0.406: P8.5 71.12,24.26 v72.52,22.86
  Bottom 0.254: v72.52,22.86 72.52,21.02 U3.23
V_PWR
  Bottom 0.762: Q1.3 78.56,26.04 77.47,27.13 P8.2
V_PWR_EN  (via drill 0.51)
  Top 0.406: v78.87,27.43 v78.87,20.83
  Bottom 0.254: v78.87,20.83 79.25,20.45 79.25,19.43 80.01,18.67 80.01,17.78 79.76,17.53 79.76,17.27 79.76,13.46 79.76,12.95 79.25,12.45 78.3,12.45 U3.34
  Bottom 0.406: v78.87,27.43 80.01,27.43 80.26,27.18 81.3,27.18 Q1.1
  Bottom 0.813: Q1.1 83.35,26.98 R14.1
V_SHDN  (via drill 0.51)
  Top 0.254: P8.14 62.23,25.86 62.23,24.13 62.87,23.5 63.5,23.5 64.14,23.5 65.28,22.35 66.17,22.35 68.2,20.32 73.28,20.32 74.55,21.59 75.44,21.59 75.95,21.08 75.95,19.56 75.44,19.05 v75.44,14.61
  Bottom 0.254: U3.35 76.2,13.41 75.95,13.67 75.44,14.18 75.44,14.73 v75.44,14.61
XTAL1
  Bottom 0.406: U3.7 64.39,8.37 64.39,6.6 65.66,5.33 67.56,3.43 67.56,2.92 | C3.2 69.34,2.92 67.56,2.92 | 67.56,2.92 Y1.2
XTAL2
  Bottom 0.254: C5.2 62.51,7.62
  Bottom 0.406: U3.8 62.51,7.62 C5.2 62.38,2.79 Y1.1